# Altium project MainControllerProject.PrjPCB
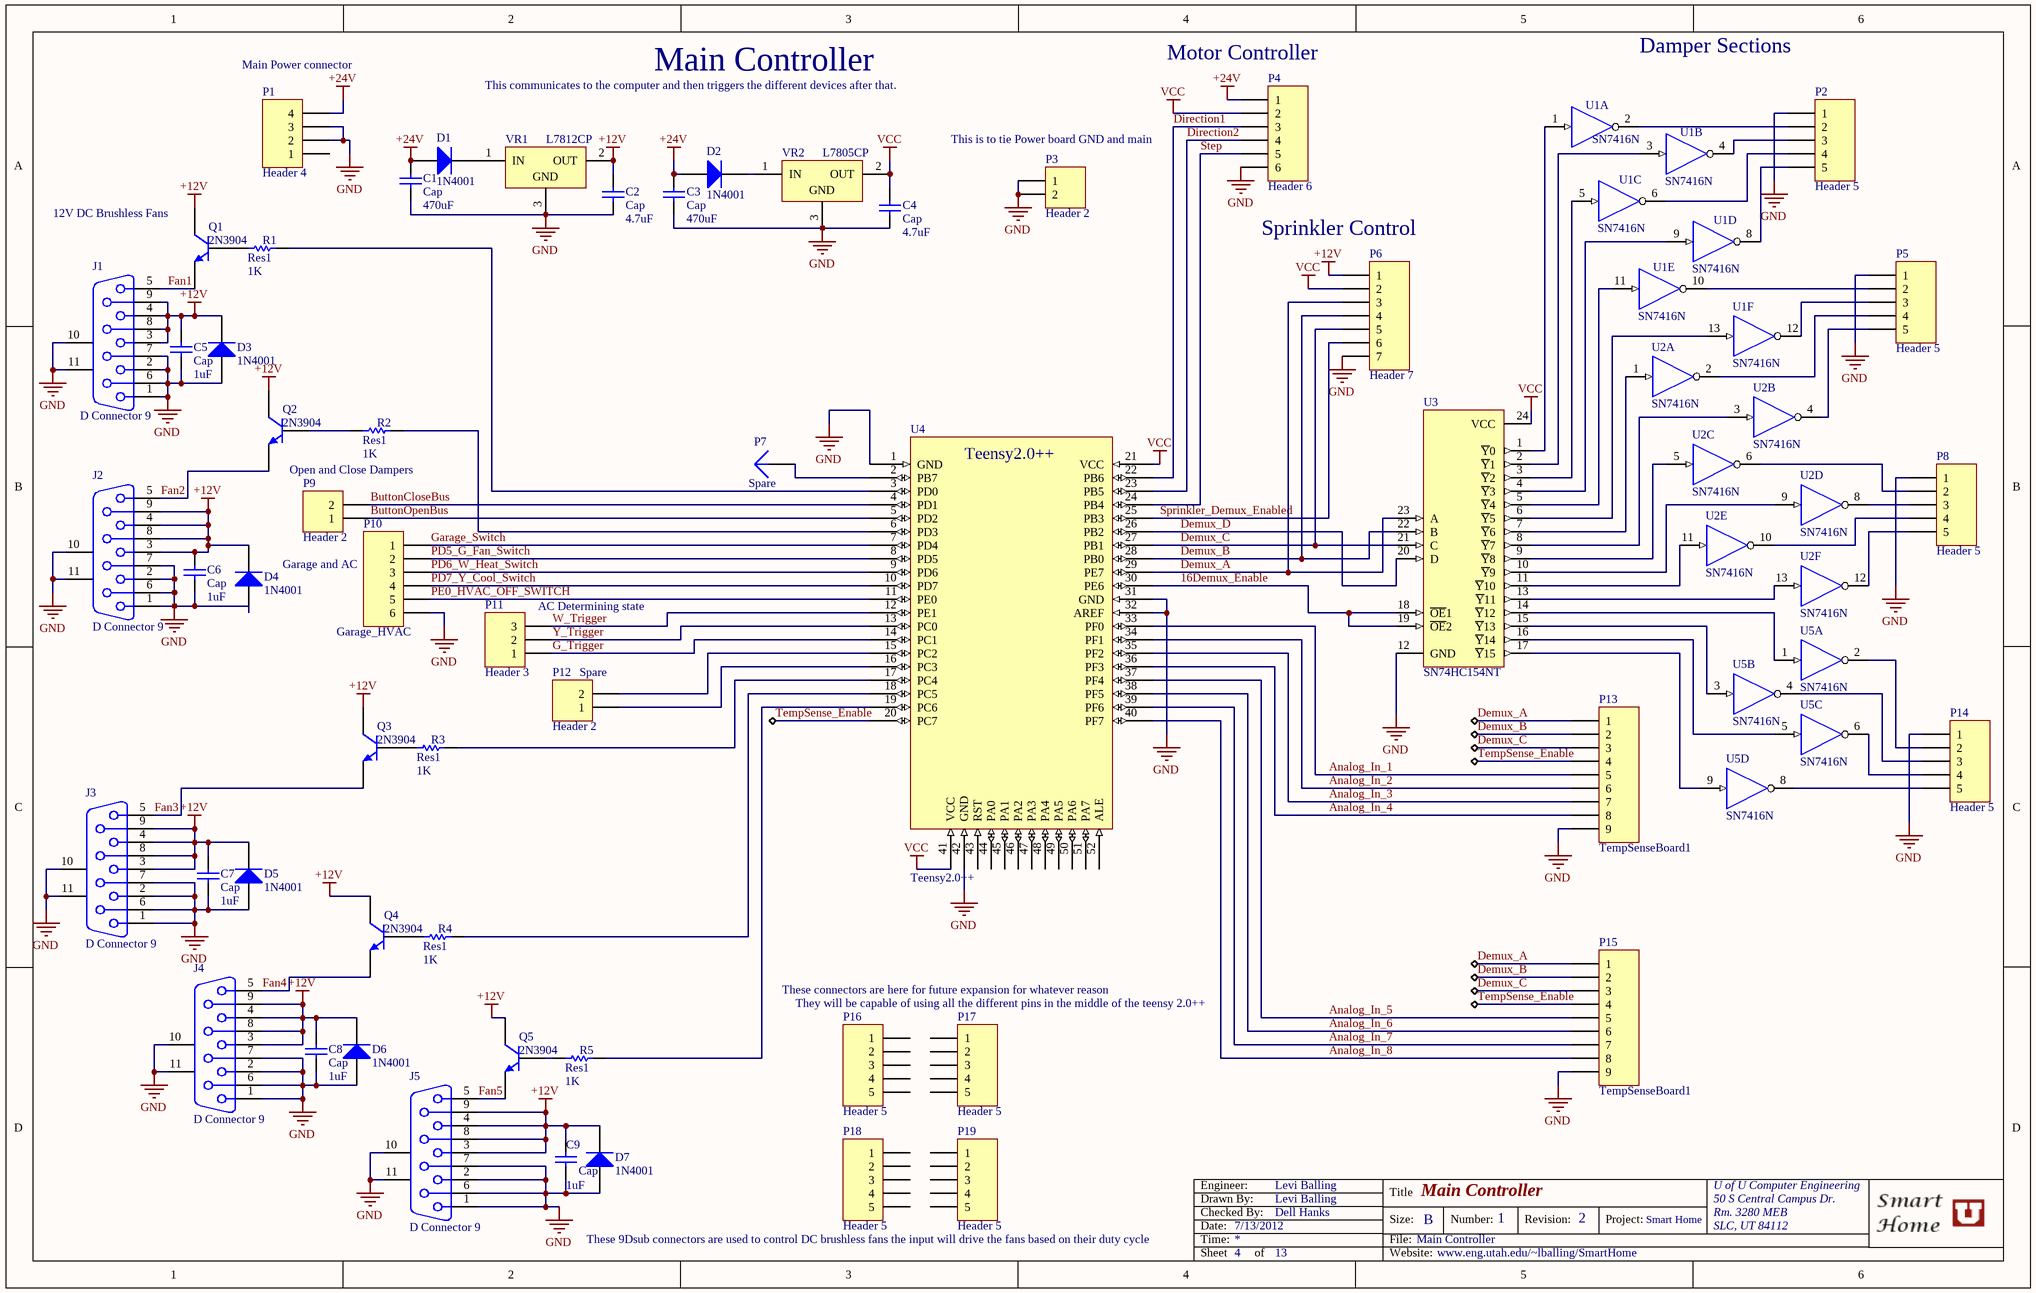
[diagram p0: MainController.SchDoc]
1 sheet, 57 parts. Net scope: global (net labels, ports and power ports of the same name join across sheets).
Board file: MainControllerPCB.PcbDoc

## Sheet MainController.SchDoc: Main Controller
size B; Date: 7/13/2012; ApprovedBy: Levi Balling; CheckedBy: Dell Hanks; Author: Levi Balling; CompanyName: Smart Home; DrawnBy: Levi Balling; Engineer: Levi Balling; Organization: U of U Computer Engineering; Address1: 50 S Central Campus Dr.; Address2: Rm. 3280 MEB; Address3: SLC, UT 84112; DocumentNumber: 1; Revision: 2; SheetNumber: 4; SheetTotal: 13; Project: Smart Home; Website: www.eng.utah.edu/~lballing/SmartHome; CurrentDate: 7/13/2012; DocumentName: Main Controller; ProjectName: Smart Home

### Parts
C1  Cap  value 470uF  [RAD-0.3]
C2  Cap  value 4.7uF  [RAD-0.3]
C3  Cap  value 470uF  [RAD-0.3]
C4  Cap  value 4.7uF  [RAD-0.3]
C5  Cap  value 1uF  [RAD-0.3]
C6  Cap  value 1uF  [RAD-0.3]
C7  Cap  value 1uF  [RAD-0.3]
C8  Cap  value 1uF  [RAD-0.3]
C9  Cap  value 1uF  [RAD-0.3]
D1  1N4001  [DO-41]
D2  1N4001  [DO-41]
D3  1N4001  [DO-41]
D4  1N4001  [DO-41]
D5  1N4001  [DO-41]
D6  1N4001  [DO-41]
D7  1N4001  [DO-41]
J1  D Connector 9  [DSUB1.385-2H9]
J2  D Connector 9  [DSUB1.385-2H9]
J3  D Connector 9  [DSUB1.385-2H9]
J4  D Connector 9  [DSUB1.385-2H9]
J5  D Connector 9  [DSUB1.385-2H9]
P1  Header 4  [MainPowerConnector]
P2  Header 5  [HDR1X5]
P3  Header 2  [HDR1X2]
P4  Header 6  [HDR1X6]
P5  Header 5  [HDR1X5]
P6  Header 7  [HDR1X7]
P7  Spare  [PIN1]
P8  Header 5  [HDR1X5]
P9  Header 2  [HDR1X2]
P10  Garage_HVAC  [HDR1X6]
P11  Header 3  [HDR1X3]
P12  Header 2  [HDR1X2]
P13  TempSenseBoard1  [HDR1X9]
P14  Header 5  [HDR1X5]
P15  TempSenseBoard1  [HDR1X9]
P16  Header 5  [HDR1X5]
P17  Header 5  [HDR1X5]
P18  Header 5  [HDR1X5]
P19  Header 5  [HDR1X5]
Q1  2N3904  [2N3904]
Q2  2N3904  [2N3904]
Q3  2N3904  [2N3904]
Q4  2N3904  [2N3904]
Q5  2N3904  [2N3904]
R1  Res1  value 1K  [AXIAL-0.3]
R2  Res1  value 1K  [AXIAL-0.3]
R3  Res1  value 1K  [AXIAL-0.3]
R4  Res1  value 1K  [AXIAL-0.3]
R5  Res1  value 1K  [AXIAL-0.3]
U1  SN7416N  [N014]  (parts A,B,C,D,E,F of 6)
U2  SN7416N  [N014]  (parts A,B,C,D,E,F of 6)
U3  SN74HC154NT  [NT024D]
U4  Teensy2.0++  [Teensy2.0++]
U5  SN7416N  [N014]  (parts A,B,C,D of 6)
VR1  L7812CP  [ISOWATT220AB]
VR2  L7805CP  [ISOWATT220AB]

### Nets
+12V: C2.1 C5.2 C6.2 C7.2 C8.2 C9.2 D3.2(K) D4.2(K) D5.2(K) D6.2(K) D7.2(K) J1.3 J1.4 J1.8 J1.9 J2.3 J2.4 J2.8 J2.9 J3.3 J3.4 J3.8 J3.9 J4.3 J4.4 J4.8 J4.9 J5.3 J5.4 J5.8 J5.9 P6.1 Q1.3(C) Q2.3(C) Q3.3(C) Q4.3(C) Q5.3(C) VR1.2(OUT)
+24V: C1.1 C3.1 D1.1(A) D2.1(A) P1.4 P4.1
GND: C1.2 C2.2 C3.2 C4.2 C5.1 C6.1 C7.1 C8.1 C9.1 D3.1(A) D4.1(A) D5.1(A) D6.1(A) D7.1(A) J1.1 J1.2 J1.6 J1.7 J1.10(MH1) J1.11(MH2) J2.1 J2.2 J2.6 J2.7 J2.10(MH1) J2.11(MH2) J3.1 J3.2 J3.6 J3.7 J3.10(MH1) J3.11(MH2) J4.1 J4.2 J4.6 J4.7 J4.10(MH1) J4.11(MH2) J5.1 J5.2 J5.6 J5.7 J5.10(MH1) J5.11(MH2) P1.2 P1.3 P2.1 P3.1 P3.2 P4.6 P5.1 P6.7 P8.1 P10.6 P13.9 P14.1 P15.9 U1.7(GND) U2.7(GND) U3.12(GND) U4.1(GND) U4.31(GND) U4.32(AREF) U4.42(GND) U5.7(GND) VR1.3(GND) VR2.3(GND)
VCC: C4.1 P4.2 P6.2 U1.14(VCC) U2.14(VCC) U3.24(VCC) U4.21(VCC) U4.41(VCC) U5.14(VCC5) VR2.2(OUT)
16Demux_Enable: U3.18(~{OE}1) U3.19(~{OE}2) U4.30(PE6)
Analog_In_1: P13.5 U4.33(PF0)
Analog_In_2: P13.6 U4.34(PF1)
Analog_In_3: P13.7 U4.35(PF2)
Analog_In_4: P13.8 U4.36(PF3)
Analog_In_5: P15.5 U4.37(PF4)
Analog_In_6: P15.6 U4.38(PF5)
Analog_In_7: P15.7 U4.39(PF6)
Analog_In_8: P15.8 U4.40(PF7)
ButtonCloseBus: P9.2 U4.4(PD1)
ButtonOpenBus: P9.1 U4.5(PD2)
Demux_A: P6.3 P13.1 P15.1 U3.23(A) U4.29(PE7)
Demux_B: P6.4 P13.2 P15.2 U3.22(B) U4.28(PB0)
Demux_C: P6.5 P13.3 P15.3 U3.21(C) U4.27(PB1)
Demux_D: U3.20(D) U4.26(PB2)
Direction1: P4.3 U4.22(PB6)
Direction2: P4.4 U4.23(PB5)
Fan1: J1.5 Q1.1(E)
Fan2: J2.5 Q2.1(E)
Fan3: J3.5 Q3.1(E)
Fan4: J4.5 Q4.1(E)
Fan5: J5.5 Q5.1(E)
G_Trigger: P11.1 U4.14(PC1)
Garage_Switch: P10.1 U4.7(PD4)
PD5_G_Fan_Switch: P10.2 U4.8(PD5)
PD6_W_Heat_Switch: P10.3 U4.9(PD6)
PD7_Y_Cool_Switch: P10.4 U4.10(PD7)
PE0_HVAC_OFF_SWITCH: P10.5 U4.11(PE0)
Sprinkler_Demux_Enabled: P6.6 U4.25(PB3)
Step: P4.5 U4.24(PB4)
TempSense_Enable: P13.4 P15.4 U4.20(PC7)
W_Trigger: P11.3 U4.12(PE1)
Y_Trigger: P11.2 U4.13(PC0)
NetD1_2: D1.2(K) VR1.1(IN)
NetD2_2: D2.2(K) VR2.1(IN)
NetP2_2: P2.2 U1.2(Y)
NetP2_3: P2.3 U1.4(Y)
NetP2_4: P2.4 U1.6(Y)
NetP2_5: P2.5 U1.8(Y)
NetP5_2: P5.2 U1.10(Y)
NetP5_3: P5.3 U1.12(Y)
NetP5_4: P5.4 U2.2(Y)
NetP5_5: P5.5 U2.4(Y)
NetP7_1: P7.1 U4.2(PB7)
NetP8_2: P8.2 U2.6(Y)
NetP8_3: P8.3 U2.8(Y)
NetP8_4: P8.4 U2.10(Y)
NetP8_5: P8.5 U2.12(Y)
NetP12_1: P12.1 U4.16(PC3)
NetP12_2: P12.2 U4.15(PC2)
NetP14_2: P14.2 U5.2(Y)
NetP14_3: P14.3 U5.4(Y)
NetP14_4: P14.4 U5.6(Y)
NetP14_5: P14.5 U5.8(Y)
NetQ1_2: Q1.2(B) R1.1
NetQ2_2: Q2.2(B) R2.1
NetQ3_2: Q3.2(B) R3.1
NetQ4_2: Q4.2(B) R4.1
NetQ5_2: Q5.2(B) R5.1
NetR1_2: R1.2 U4.3(PD0)
NetR2_2: R2.2 U4.6(PD3)
NetR3_2: R3.2 U4.17(PC4)
NetR4_2: R4.2 U4.18(PC5)
NetR5_2: R5.2 U4.19(PC6)
NetU1_1: U1.1(A) U3.1(~{Y}0)
NetU1_3: U1.3(A) U3.2(~{Y}1)
NetU1_5: U1.5(A) U3.3(~{Y}2)
NetU1_9: U1.9(A) U3.4(~{Y}3)
NetU1_11: U1.11(A) U3.5(~{Y}4)
NetU1_13: U1.13(A) U3.6(~{Y}5)
NetU2_1: U2.1(A) U3.7(~{Y}6)
NetU2_3: U2.3(A) U3.8(~{Y}7)
NetU2_5: U2.5(A) U3.9(~{Y}8)
NetU2_9: U2.9(A) U3.10(~{Y}9)
NetU2_11: U2.11(A) U3.11(~{Y}10)
NetU2_13: U2.13(A) U3.13(~{Y}11)
NetU3_14: U3.14(~{Y}12) U5.1(A)
NetU3_15: U3.15(~{Y}13) U5.3(A)
NetU3_16: U3.16(~{Y}14) U5.5(A)
NetU3_17: U3.17(~{Y}15) U5.9(A)

Not connected (* = marked no-connect by the designer): P1 1; P16 1 2 3 4 5; P17 1 2 3 4 5; P18 1 2 3 4 5; P19 1 2 3 4 5; U4 43(RST) 44(PA0) 45(PA1) 46(PA2) 47(PA3) 48(PA4) 49(PA5) 50(PA6) 51(PA7) 52(ALE)

### Notes on the sheet
- (near P1) Main Power connector
- This communicates to the computer and then triggers the different devices after that.
- (near P4) Motor Controller
- Damper Sections
- (near P3) This is to tie Power board GND and main
- (near Q1) 12V DC Brushless Fans
- Sprinkler Control
- Open and Close Dampers
- Garage and AC
- (near P11) AC Determining state
- (near P12) Spare
- These connectors are here for future expansion for whatever reason
- They will be capable of using all the different pins in the middle of the teensy 2.0++
- These 9Dsub connectors are used to control DC brushless fans the input will drive the fans based on their duty cycle
- Date:
- Time:
- Engineer:
- Drawn By:
- Checked By:
- Title
- Size:
- File:
- B
- Number:
- Revision:
- Project:
- Sheet
- of
- Website:

### Library data of the parts
C1-C9 = Cap: Capacitor; Vendor: Taydaelectronics; Published: 8-Jun-2000; LatestRevisionDate: 17-Jul-2002; LatestRevisionNote: Re-released for DXP Platform.; PackageReference: RAD-0.3; Publisher: Altium Limited; PackageDescription: Radial Cap, Thru-Hole; 2 Leads; 0.3 in Pin Spacing; Price: 0.03
D1 D2 = Diode 1N4001: 1 Amp General Purpose Rectifier; Vendor: Taydaelectronics; Published: 8-Jun-2000; LatestRevisionDate: 17-Jul-2002; LatestRevisionNote: Re-released for DXP Platform.; DatasheetVersion: 1998; PackageVersion: Aug-1999; PackageReference: DO-41; Publisher: Altium Limited; PackageDescription: Diode, Axial; Body 5.2 x 2.7 mm (LxDia. max), Lead Dia. 0.86 mm (max); Code_JEDEC: DO-204-AL; ComponentLink1URL: http://www.fairchildsemi.com/; ComponentLink2Description: Datasheet; ComponentLink2URL: http://www.fairchildsemi.com/ds/1N%2F1N4001.pdf; Price: 0.01; Value: 1N4001
D3-D7 = 1N4001: 1.0 Ampere General Purpose Rectifier; Vendor: Taydaelectronics; Published: 8-Jun-2000; LatestRevisionDate: 17-Jul-2002; LatestRevisionNote: Re-released for DXP Platform.; DatasheetDocument: 1998; PackageDocument: Aug-1999; PackageReference: DO-41; Publisher: Altium Limited; Code_JEDEC: DO-204-AL; ComponentLink1Description: Manufacturer Link; ComponentLink1URL: http://www.fairchildsemi.com/; ComponentLink2Description: Pinout Specification; ComponentLink2URL: http://www.fairchildsemi.com/ds/1N%2F1N4001.pdf; Price: 0.01; Value: 1N4001
J1-J5 = D Connector 9: Receptacle Assembly, 9 Position, Right Angle; PackageDocument: O; Positions: 9; Vendor: Taydaelectronics; Published: 15-Jun-2001; LatestRevisionDate: 17-Jul-2002; LatestRevisionNote: Re-released for DXP Platform.; DatasheetDocument: 1-Sep-1999; PackageReference: 788750; Publisher: Altium Limited; Orientation: Right Angle; Gender: Receptacle; Price: 0.48; Value: D Connector 9
P1 = Header 4: Header, 4-Pin; Vendor: Taydaelectronics; LatestRevisionDate: 17-Jul-2002; LatestRevisionNote: Re-released for DXP Platform.; Publisher: Altium Limited; Price: 0.04; Value: Header 4
P2 P5 P8 P14 P16-P19 = Header 5: Header, 5-Pin; Vendor: Taydaelectronics; LatestRevisionDate: 17-Jul-2002; LatestRevisionNote: Re-released for DXP Platform.; Publisher: Altium Limited; Price: 0.05; Value: Header 5
P3 P9 P12 = Header 2: Header, 2-Pin; Vendor: Taydaelectronics; LatestRevisionDate: 17-Jul-2002; LatestRevisionNote: Re-released for DXP Platform.; Publisher: Altium Limited; Price: 0.02; Value: Header 2
P4 P10 = Header 6: Header, 6-Pin; Vendor: Taydaelectronics; LatestRevisionDate: 17-Jul-2002; LatestRevisionNote: Re-released for DXP Platform.; Publisher: Altium Limited; Price: 0.06; Value: Header 6
P6 = Header 7: Header, 7-Pin; Vendor: Taydaelectronics; LatestRevisionDate: 17-Jul-2002; LatestRevisionNote: Re-released for DXP Platform.; Publisher: Altium Limited; Price: 0.07; Value: Header 7
P7 = Plug: Vendor: Taydaelectronics; LatestRevisionDate: 17-Jul-2002; LatestRevisionNote: Re-released for DXP Platform.; Publisher: Altium Limited; Price: 0.00; Value: Plug
P11 = Header 3: Header, 3-Pin; Vendor: Taydaelectronics; LatestRevisionDate: 17-Jul-2002; LatestRevisionNote: Re-released for DXP Platform.; Publisher: Altium Limited; Price: 0.03; Value: Header 3
P13 P15 = Header 9: Header, 9-Pin; Vendor: Taydaelectronics; LatestRevisionDate: 17-Jul-2002; LatestRevisionNote: Re-released for DXP Platform.; Publisher: Altium Limited; Price: 0.09; Value: Header 9
Q1-Q5 = 2N3904: NPN General Purpose Amplifier; Vendor: Taydaelectronics; Published: 8-Jun-2000; LatestRevisionDate: 15-Jan-2003; LatestRevisionNote: PCB Footprint 'BCY-W3/D4.7' replaced; DatasheetVersion: 1997; PackageVersion: Sep-1998; PackageReference: TO-92A; Publisher: Altium Limited; PackageDescription: TO, Flat Index; 3 In-Line, Axial Leads; Body Dia. 4.5mm; Leads 0.51 x 0.48 mm (max); ComponentLink1URL: http://www.fairchildsemi.com/; ComponentLink2Description: Datasheet; ComponentLink2URL: http://www.fairchildsemi.com/ds/2N%2F2N3904.pdf; Price: 0.01; Value: 2N3904
R1-R5 = Res1: Resistor; Vendor: Taydaelectronics; Published: 8-Jun-2000; LatestRevisionDate: 17-Jul-2002; LatestRevisionNote: Re-released for DXP Platform.; PackageReference: AXIAL-0.3; Publisher: Altium Limited; PackageDescription: Axial Device, Thru-Hole; 2 Leads; 0.3 in Pin Spacing; Price: 0.01
U1 U2 U5 = SN7416N: Hex Inverter Buffer / Driver with High-Voltage Outputs; Vendor: Taydaelectronics; Published: 8-Jun-2000; LatestRevisionDate: 04-Mar-2005; LatestRevisionNote: Stylized 3D Model Added.; DatasheetVersion: Mar-1988; PackageVersion: Oct-1995; PackageReference: N014; Publisher: Altium Limited; PackageDescription: DIP; 14 Leads; Row Spacing 7.62 mm; Pitch 2.54 mm; ComponentLink1URL: http://www.ti.com/; ComponentLink2Description: Datasheet; ComponentLink2URL: http://www-s.ti.com/sc/ds/sn5416.pdf; ComponentLink3Description: Packaging Specification; ComponentLink3URL: http://focus.ti.com/lit/ml/mpdi002c/mpdi002c.pdf; Price: 0.18; Value: SN7416N
U3 = SN74HC154NT: 4-Line to 16-Line Decoder / Demultiplexer; ComponentAvailability: Obsolete; Vendor: Digi-Key; Published: 8-Jun-2000; LatestRevisionDate: 04-Mar-2005; LatestRevisionNote: Stylized 3D Model Added.; DatasheetVersion: Sep-1987; PackageVersion: Oct-1994; PackageReference: NT024D; Publisher: Altium Limited; PackageDescription: DIP; 24 Leads; Row Spacing 7.62 mm; Pitch 2.54 mm; Code_JEDEC: MS-001-AF; ComponentLink1URL: http://www.ti.com/; ComponentLink2Description: Discontinuation Notice; ComponentLink2URL: http://focus.ti.com/docs/prod/folders/print/sn74hc154.html; Price: 3.70; Value: SN74HC154NT
U4 = Teensy2.0++: The teensy 2.0 from www.PJRC.com; Vendor: PJRC; Vendor: Taydaelectronics; Price: 24.0; Value: Teensy2.0++
VR1 VR2 = L7805CP: Positive Voltage Regulator; Note: Tab is connected to pin 3 (GND).; Vendor: Taydaelectronics; Published: 24-Aug-2001; LatestRevisionDate: 17-Jul-2002; LatestRevisionNote: Re-released for DXP Platform.; DatasheetVersion: Dec-1998; PackageVersion: Jul-1998; PackageReference: ISOWATT220AB; Publisher: Altium Limited; PackageDescription: TO, Thru-Hole, Vertical, Heatsink Mounted; 3 In-Line Leads; Pitch 2.54 mm; Pin sequence 1, 3, 2; ComponentLink1URL: http://www.st.com/; Price: 0.24
  VR1: Value: L7812CP
  VR2: Value: L7805CP